# Altium schematic sheet main.SchDoc
size A4; SheetNumber: 1; SheetTotal: 1
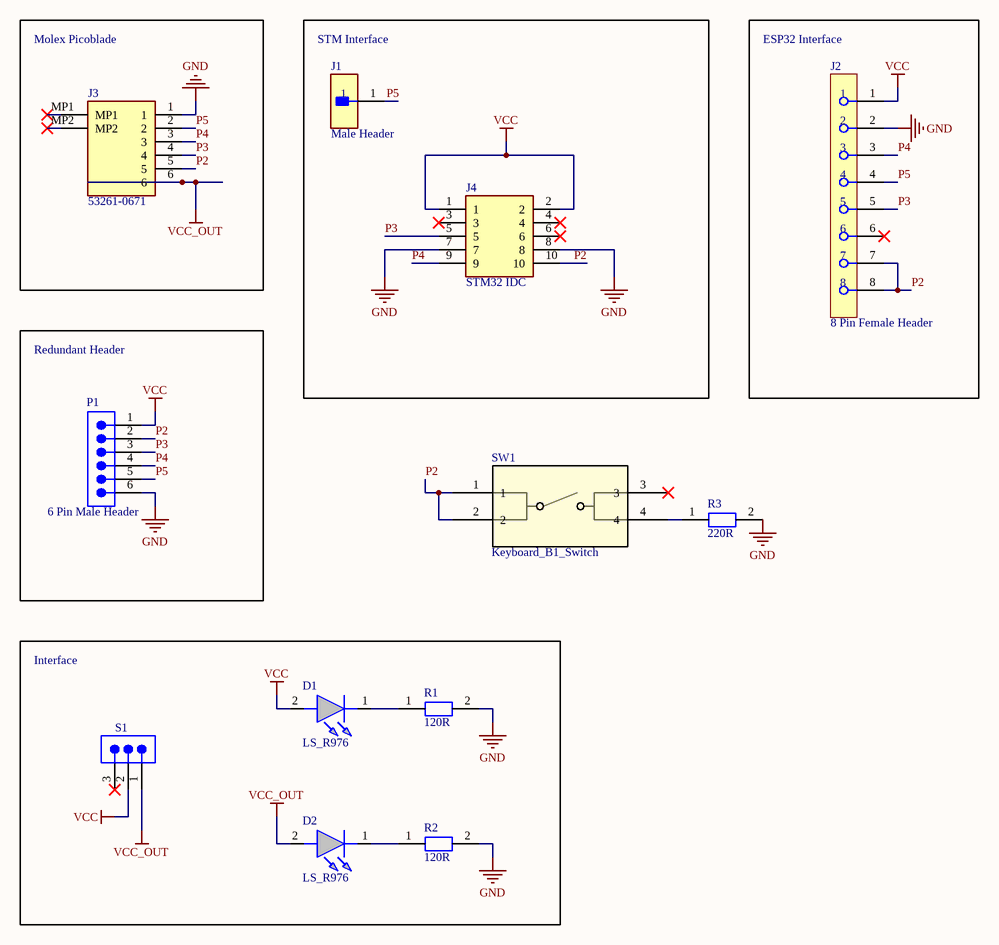
[diagram p0: main.SchDoc]

## Parts
D1  LS_R976  [LEDC2012X40N]
D2  LS_R976  [LEDC2012X40N]
J1  Male Header  [FP-HTSW-101-07-L-S-MFG]
J2  8 Pin Female Header  [FP-RS1-08-G-MFG]
J3  53261-0671  [532610671]
J4  STM32 IDC  [DS101310SSIB1B0]
P1  6 Pin Male Header  [SMTC-TSW-106-23-X-S]
R1  120R  [Res_0603_Medium_Density]
R2  120R  [Res_0603_Medium_Density]
R3  220R  [Res_0603_Medium_Density]
S1  TSW-103-07-T-S  [SMTC-TSW-103-07-X-S]  (value not drawn)
SW1  Keyboard_B1_Switch  [SW4_FSM-5P23_TEC]

## Blocks framed on the sheet
Molex Picoblade: J3
STM Interface: J1 J4
ESP32 Interface: J2
Redundant Header: P1
Interface: D1 D2 R1 R2 S1

## Nets
GND: J2.2 J3.1 J4.7 J4.8 P1.6 R1.2 R2.2 R3.2
VCC: D1.2(A) J2.1 J4.1 J4.2 P1.1 S1.2
VCC_OUT: D2.2(A) J3.6 S1.1
P2: J2.7 J2.8 J3.5 J4.10 P1.2 SW1.1 SW1.2
P3: J2.5 J3.4 J4.5 P1.3
P4: J2.3 J3.3 J4.9 P1.4
P5: J1.1 J2.4 J3.2 P1.5
NetD1_1: D1.1(K) R1.1
NetD2_1: D2.1(K) R2.1
NetR3_1: R3.1 SW1.4

Not connected (* = marked no-connect by the designer): J2 6*; J3 MP1* MP2*; J4 3* 4* 6*; S1 3*; SW1 3*

## Library data of the parts
D1 D2 = LS_R976: Red 0805 CHIPLED LS R976N-R102 Osram Opto LS R976, CHIPLED 0805 Series Red LED, 633 nm, 2012 (0805), Rectangle Lens SMD Package; Manufacturer_Name: ams OSRAM; Manufacturer_Part_Number: LS R976; Geometry.Height: 0.4mm; Mouser Part Number: 720-LSR976D5178; Mouser Price/Stock: https://www.mouser.co.uk/ProductDetail/OSRAM-Opto-Semiconductors/LS-R976?qs=OIr7YF%252B2cWVTfzKl425Fkw%3D%3D; Datasheet Link: http://uk.rs-online.com/web/p/products/4974804; Part Number: LS R976; Supplier: Mouser
J1 = CMP-02766-001464-1: CONN HEADER VERT 1POS; Number of Contacts: 1; Max Voltage Rating (AC): 550V; Max Current Rating: 7.6A; Contact Material: Bronze; REACH SVHC: No SVHC; Contact Plating: Gold; Length: 2.54mm; Gender: Male; Housing Color: Natural; Number of Rows: 1; Orientation: Straight; Max Operating Temperature: 125°C; Min Operating Temperature: -55°C; RoHS Compliant: Yes; Housing Material: Polymer; Packaging: Bulk; Depth: 2.48mm; Termination: Solder; Radiation Hardening: No
J2 = CMP-02275-20083808-1: RS1-08-G Connector, receptacle strip, 8 position, 2.54MM pitch, single row; Number of Contacts: 8; Current Rating: 3A; Pitch: 2.54mm; Height: 8.89mm; Max Operating Temperature: 105°C; Schedule B: 8536694040, 8536694040; Number of Rows: 1; Contact Material: Gold, Nickel; RoHS: Compliant; Termination: PCB; NexarPartId: 20083808; Min Operating Temperature: -40°C; Contact Gender: Female
J3 = 53261-0671: 1.25mm Pitch, PicoBlade PCB Header, Single Row, Right-Angle, Surface Mount, Tin (Sn) Plating, Friction Lock,  Circuits, Tape and Reel; Manufacturer_Name: Molex; Geometry.Height: 3.6mm; Manufacturer_Part_Number: 53261-0671; Mouser Part Number: 538-53261-0671; Mouser Price/Stock: https://www.mouser.co.uk/ProductDetail/Molex/53261-0671?qs=%252B72YyncTwW9Wyr77z4J2cA%3D%3D; Arrow Part Number: 53261-0671; Arrow Price/Stock: https://www.arrow.com/en/products/53261-0671/molex?region=nac; Datasheet Link: https://www.molex.com/pdm_docs/sd/532610671_sd.pdf
J4 = DS1013-10SSIB1-B-0: Socket; IDC; male; PIN: 10; straight; THT; gold-plated; 2.54mm; Manufacturer_Name: Connfly; Geometry.Height: 9.48mm; Manufacturer_Part_Number: DS1013-10SSIB1-B-0; Mouser Part Number: *; Mouser Price/Stock: *; Arrow Part Number: *; Arrow Price/Stock: *; Datasheet Link: https://www.tme.eu/Document/c6e6da985bd9c519d97c4924b5c8a047/DS1013.pdf
P1 = CMP-1024-00398-1: 0.025" SQ Post Header, Through-hole, Vertical, -55 to 125 degC, 2.54 mm Pitch, 6-Pin, Male, RoHS; Manufacturer: Samtec; PartNumber: TSW-106-23-F-S; Pitch: 2.54 mm; ComponentLink3Description: Package Specification; ComponentLink3URL: http://www.samtec.com/documents/webfiles/cpdf/TSW-XXX-XX-XXX-X-XX-XXX-MKT.pdf; Orientation: Vertical; ComponentLink1Description: Manufacturer URL; ComponentLink1URL: http://www.samtec.com; Mounting Technology: Through-hole; ComponentLink2URL: http://www.samtec.com/documents/webfiles/pdf/TSW_TH.PDF; PackageDescription: .025[0.64] SQ. Post Terminal Strip Assembly; DatasheetVersion: F-214; PackageVersion: DM, 8/1988; Temperature Range: -55 to 125 degC; ComponentLink2Description: Datasheet; RoHS: True; PackageReference: TSW-106-23-X-S
R1 R2 = Resistor_SMD: Part Number: CR0603-JW-121ELF; Value: 120R; Manufacturer: *; Supplier: Mouser; Voltage: *; ComponentLink1Description: Online Store Link; ComponentLink1URL: *; Package: 0603
R3 = Resistor_SMD: Part Number: CR0603-JW-221ELF; Value: 220R; Manufacturer: *; Supplier: Mouser; Voltage: *; ComponentLink1Description: Online Store Link; ComponentLink1URL: *; Package: 0603
S1 = CMP-1024-00332-1: 0.025" SQ Post Header, Through-hole, Vertical, -55 to 105 degC, 2.54 mm Pitch, 3-Pin, Male, RoHS; Manufacturer: Samtec; Pitch: 2.54 mm; ComponentLink1URL: http://www.samtec.com; ComponentLink3URL: http://www.samtec.com/documents/webfiles/cpdf/TSW-XXX-XX-XXX-X-XX-XXX-MKT.pdf; PartNumber: TSW-103-07-T-S; Mounting Technology: Through-hole; RoHS: True; DatasheetVersion: F-214; PackageVersion: DM, 8/1988; Temperature Range: -55 to 105 degC; ComponentLink2Description: Datasheet; ComponentLink1Description: Manufacturer URL; Orientation: Vertical; PackageReference: TSW-103-07-X-S; ComponentLink3Description: Package Specification; ComponentLink2URL: http://www.samtec.com/documents/webfiles/pdf/TSW_TH.PDF; PackageDescription: .025[0.64] SQ. Post Terminal Strip Assembly
SW1 = 1571563-4: FSM4JSMAATR=TACTSWITCH,SMT,T&R; Manufacturer_Name: TE Connectivity; Copyright: Copyright (C) 2025 Ultra Librarian. All rights reserved.; Manufacturer_Part_Number: 1571563-4; RefDes: RefDes; Type: Type